# EAGLE design bldc (EAGLE 6.4)
Assembly variants: IRLR8726PBF
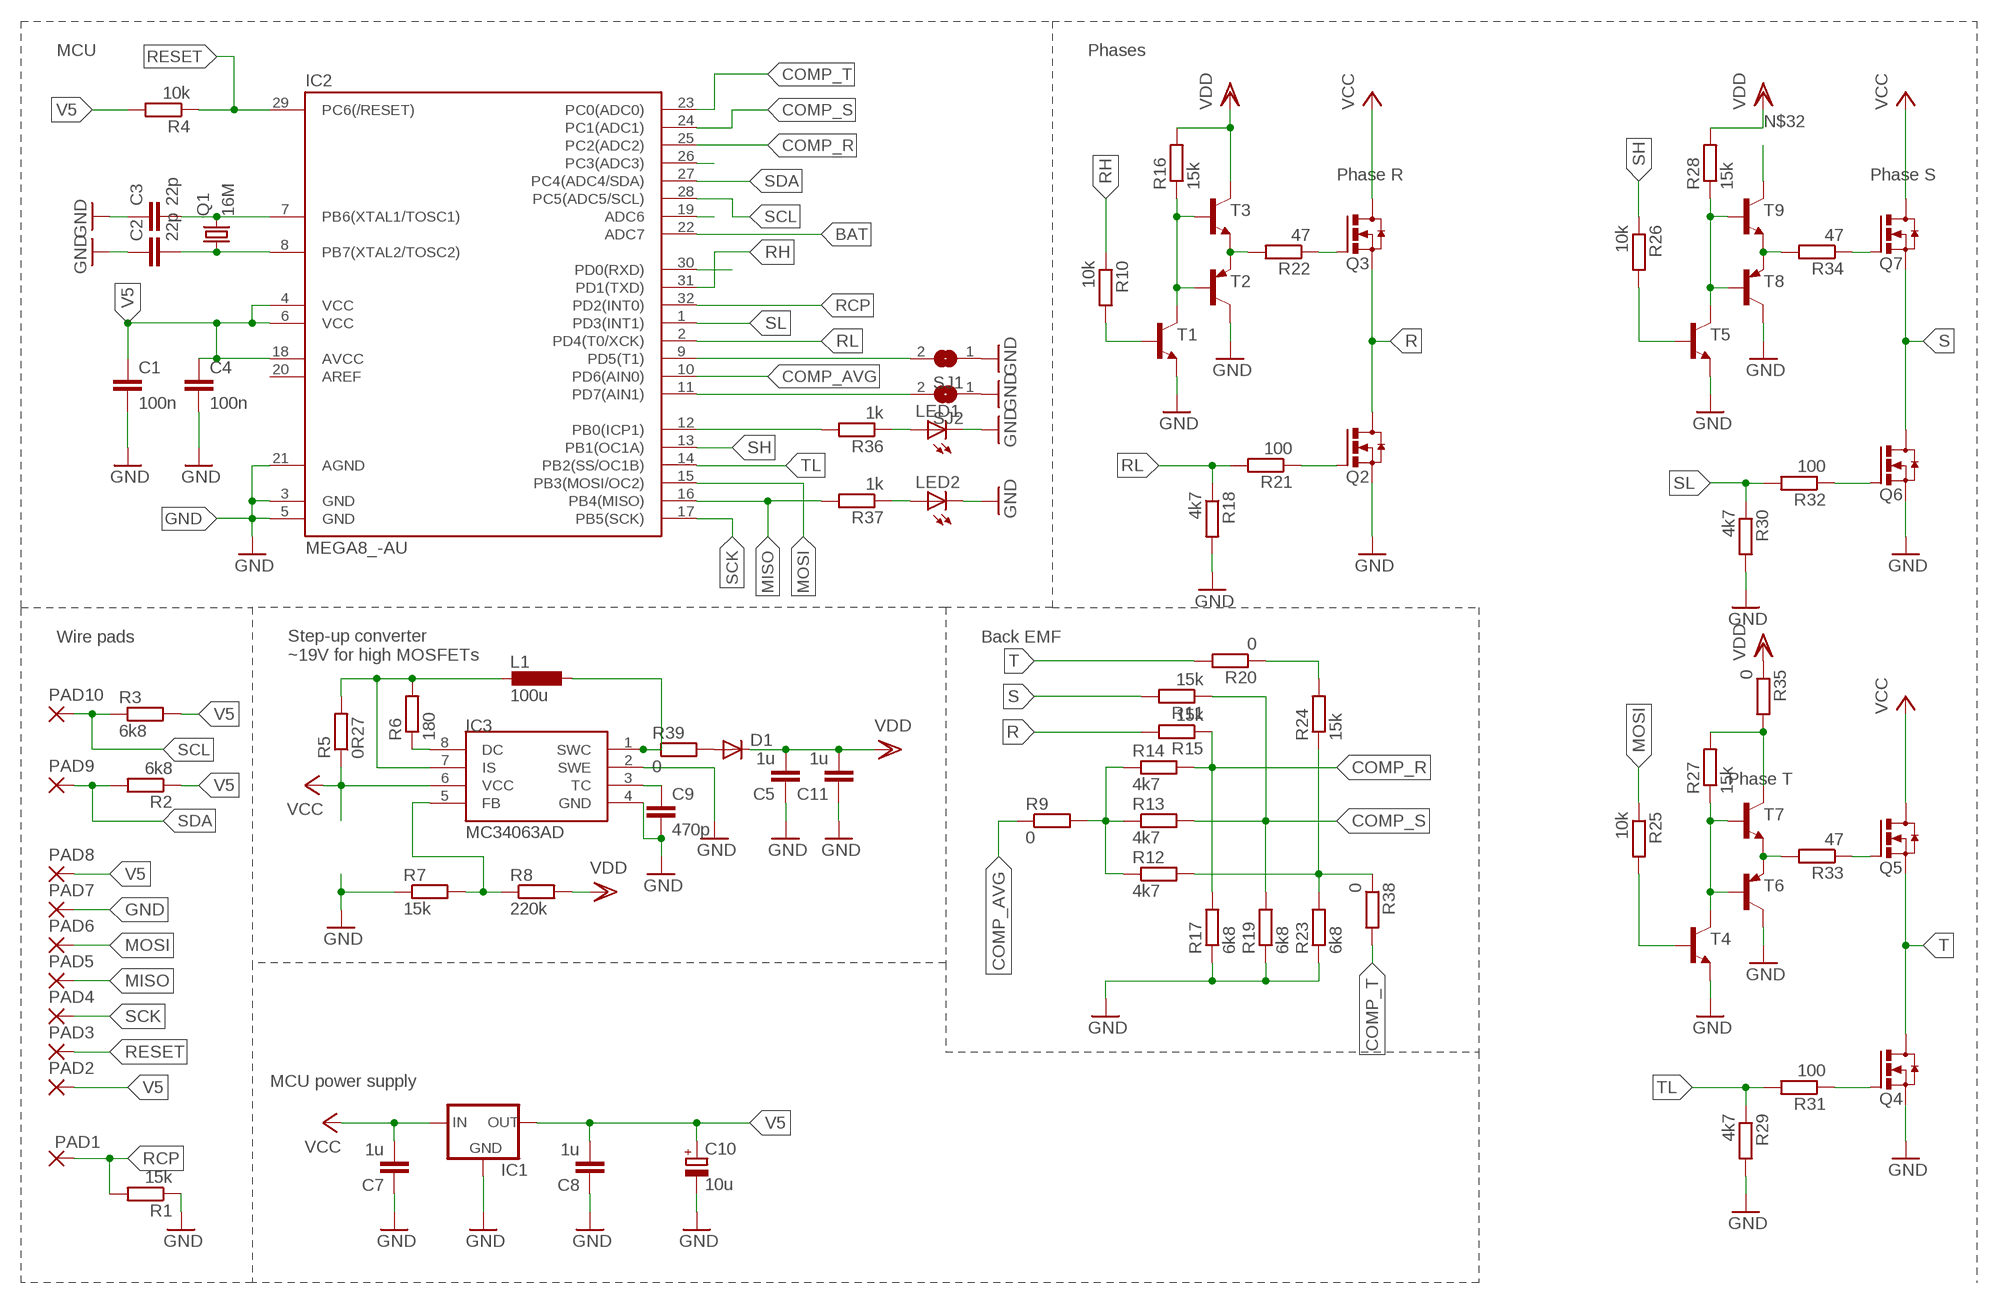
[diagram p0: schematic, sheet 1]

## Parts
C1  100n  C-EUC0805K  [C0805K]
C2  22p  C-EUC0805K  [C0805K]
C3  22p  C-EUC0805K  [C0805K]
C4  100n  C-EUC0805K  [C0805K]
C5  1u  C-EUC0805K  [C0805K]
C7  1u  C-EUC0805K  [C0805K]
C8  1u  C-EUC0805K  [C0805K]
C9  470p  C-EUC0805K  [C0805K]
C10  10u  CPOL-EUE2.5-4V  [E2,5RE]
C11  1u  C-EUC0805K  [C0805K]
D1  DIODE-SOD80C  [SOD80C]
IC1  LM1117TO252  [TO252]
IC2  MEGA8_-AU  [TQFP32-08]
IC3  MC34063AD  [SOIC8]
L1  100u  L-EU0204/7  [0204/7]
LED1  LEDCHIPLED_0805  [CHIPLED_0805]
LED2  LEDCHIPLED_0805  [CHIPLED_0805]
PAD1  WIREPADSMD1,27-254  [SMD1,27-2,54]
PAD2  WIREPADSMD1,27-254  [SMD1,27-2,54]
PAD3  WIREPADSMD1,27-254  [SMD1,27-2,54]
PAD4  WIREPADSMD1,27-254  [SMD1,27-2,54]
PAD5  WIREPADSMD1,27-254  [SMD1,27-2,54]
PAD6  WIREPADSMD1,27-254  [SMD1,27-2,54]
PAD7  WIREPADSMD1,27-254  [SMD1,27-2,54]
PAD8  WIREPADSMD1,27-254  [SMD1,27-2,54]
PAD9  WIREPADSMD1,27-254  [SMD1,27-2,54]
PAD10  WIREPADSMD1,27-254  [SMD1,27-2,54]
Q1  16M  CRYSTALSM49  [SM49]
Q2  IRFR1205  [D-PAK_TO252AA]
Q3  IRFR1205  [D-PAK_TO252AA]
Q4  IRFR1205  [D-PAK_TO252AA]
Q5  IRFR1205  [D-PAK_TO252AA]
Q6  IRFR1205  [D-PAK_TO252AA]
Q7  IRFR1205  [D-PAK_TO252AA]
R1  15k  R-EU_R0805  [R0805]
R2  6k8  R-EU_R0805  [R0805]
R3  6k8  R-EU_R0805  [R0805]
R4  10k  R-EU_R0805  [R0805]
R5  0R27  R-EU_R0805  [R0805]
R6  180  R-EU_R0805  [R0805]
R7  15k  R-EU_R0805  [R0805]
R8  220k  R-EU_R0805  [R0805]
R9  0  R-EU_R0805  [R0805]
R10  10k  R-EU_R0805  [R0805]
R11  15k  R-EU_R0805  [R0805]
R12  4k7  R-EU_R0805  [R0805]
R13  4k7  R-EU_R0805  [R0805]
R14  4k7  R-EU_R0805  [R0805]
R15  15k  R-EU_R0805  [R0805]
R16  15k  R-EU_R0805  [R0805]
R17  6k8  R-EU_R0805  [R0805]
R18  4k7  R-EU_R0805  [R0805]
R19  6k8  R-EU_R0805  [R0805]
R20  0  R-EU_WIDE1206  [R1206]
R21  100  R-EU_R0805  [R0805]
R22  47  R-EU_R0805  [R0805]
R23  6k8  R-EU_R0805  [R0805]
R24  15k  R-EU_R0805  [R0805]
R25  10k  R-EU_R0805  [R0805]
R26  10k  R-EU_R0805  [R0805]
R27  15k  R-EU_R0805  [R0805]
R28  15k  R-EU_R0805  [R0805]
R29  4k7  R-EU_R0805  [R0805]
R30  4k7  R-EU_R0805  [R0805]
R31  100  R-EU_R0805  [R0805]
R32  100  R-EU_R0805  [R0805]
R33  47  R-EU_R0805  [R0805]
R34  47  R-EU_R0805  [R0805]
R35  0  R-EU_WIDE1206  [R1206]
R36  1k  R-EU_R0805  [R0805]
R37  1k  R-EU_R0805  [R0805]
R38  0  R-EU_R0805  [R0805]
R39  0  R-EU_R0805  [R0805]
SJ1  SJ  [SJ]
SJ2  SJ  [SJ]
T1  BC847  [SOT23]
T2  BC807-16-PNP-SOT23-BEC  [SOT23-BEC]
T3  BC847  [SOT23]
T4  BC847  [SOT23]
T5  BC847  [SOT23]
T6  BC807-16-PNP-SOT23-BEC  [SOT23-BEC]
T7  BC847  [SOT23]
T8  BC807-16-PNP-SOT23-BEC  [SOT23-BEC]
T9  BC847  [SOT23]

## Nets
BAT: IC2.22(ADC7)
COMP_AVG: IC2.10(PD6(AIN0)) R9.1
COMP_R: IC2.25(PC2(ADC2)) R14.2 R15.1 R17.2
COMP_S: IC2.24(PC1(ADC1)) R11.1 R13.2 R19.2
COMP_T: IC2.23(PC0(ADC0)) R38.2
GND: C1.2 C2.1 C3.1 C4.2 C5.1 C7.1 C8.1 C9.2 C10.- C11.1 IC1.1(GND) IC2.3(GND) IC2.5(GND) IC2.21(AGND) IC3.2(SWE) IC3.4(GND) LED1.C LED2.C PAD7.1(P) Q2.3(S) Q4.3(S) Q6.3(S) R1.1 R7.1 R17.1 R18.2 R19.1 R23.1 R29.2 R30.2 SJ1.1 SJ2.1 T1.2(E) T2.C T4.2(E) T5.2(E) T6.C T8.C
MISO: IC2.16(PB4(MISO)) PAD5.1(P) R37.2
MOSI: IC2.15(PB3(MOSI/OC2)) PAD6.1(P) R25.1
N$1: R10.2 T1.1(B)
N$3: R9.2 R12.1 R13.1 R14.1
N$4: R16.1 T1.3(C) T2.B T3.1(B)
N$5: Q3.1(G) R22.1
N$6: R22.2 T2.E T3.2(E)
N$9: Q4.1(G) R31.1
N$10: Q2.1(G) R21.1
N$11: Q6.1(G) R32.1
N$13: IC3.5(FB) R7.2 R8.1
N$14: IC3.8(DC) R6.1
N$15: IC3.1(SWC) L1.1 R39.1
N$16: IC3.7(IS) L1.2 R5.2 R6.2
N$17: R28.1 T5.3(C) T8.B T9.1(B)
N$18: C2.2 IC2.8(PB7(XTAL2/TOSC2)) Q1.1
N$19: C3.2 IC2.7(PB6(XTAL1/TOSC1)) Q1.2
N$22: Q7.1(G) R34.1
N$23: R34.2 T8.E T9.2(E)
N$24: R26.2 T5.1(B)
N$26: Q5.1(G) R33.1
N$28: R20.1 R24.2
N$30: R27.1 T4.3(C) T6.B T7.1(B)
N$31: R33.2 T6.E T7.2(E)
N$32: R27.2 R35.2 T7.3(C) T9.3(C)
N$33: IC2.12(PB0(ICP1)) R36.2
N$35: IC2.11(PD7(AIN1)) SJ2.2
N$36: R25.2 T4.1(B)
N$37: IC2.9(PD5(T1)) SJ1.2
N$40: IC2.30(PD0(RXD))
N$41: IC2.19(ADC6)
N$43: IC2.26(PC3(ADC3))
N$46: LED2.A R37.1
N$47: LED1.A R36.1
N$48: R12.2 R23.2 R24.1 R38.1
N$50: C9.1 IC3.3(TC)
N$55: D1.A R39.2
R: Q2.4(D) Q3.3(S) R15.2
RCP: IC2.32(PD2(INT0)) PAD1.1(P) R1.2
RESET: IC2.29(PC6(/RESET)) PAD3.1(P) R4.1
RH: IC2.31(PD1(TXD)) R10.1
RL: IC2.2(PD4(T0/XCK)) R18.1 R21.2
S: Q6.4(D) Q7.3(S) R11.2
SCK: IC2.17(PB5(SCK)) PAD4.1(P)
SCL: IC2.28(PC5(ADC5/SCL)) PAD10.1(P) R3.1
SDA: IC2.27(PC4(ADC4/SDA)) PAD9.1(P) R2.2
SH: IC2.13(PB1(OC1A)) R26.1
SL: IC2.1(PD3(INT1)) R30.1 R32.2
T: Q4.4(D) Q5.3(S) R20.2
TL: IC2.14(PB2(SS/OC1B)) R29.1 R31.2
V5: C1.1 C4.1 C8.2 C10.+ IC1.3(OUT) IC2.4(VCC) IC2.6(VCC) IC2.18(AVCC) PAD2.1(P) PAD8.1(P) R2.1 R3.2 R4.2
VCC: C7.2 IC1.2(IN) IC3.6(VCC) Q3.4(D) Q5.4(D) Q7.4(D) R5.1
VDD: C5.2 C11.2 D1.C R8.2 R16.2 R28.2 R35.1 T3.3(C)
Unconnected: IC2.20(AREF)

## Notes on the sheet
- MCU | Phases
- Phase R | Phase S
- Wire pads | Back EMF
- Step-up converter
  ~19V for high MOSFETs
- Phase T
- MCU power supply

## Library data of the parts
C1-C5 C7 C8 C11 = rcl2:C-EU: CAPACITOR, European symbol
C9 = rcl:C-EU: CAPACITOR, European symbol
C10 = rcl:CPOL-EU: POLARIZED CAPACITOR, European symbol
D1 = diode:DIODE-: DIODE
IC1 = v-reg-2:LM1117
IC2 = avr-4:MEGA8_
IC3 = mc34063:MC34063
L1 = rcl:L-EU: INDUCTOR, European symbol
LED1 LED2 = led:LED: LED OSRAM: - CHIPLED LG R971, LG N971, LY N971, LG Q971, LY Q971, LO R971, LY R971 LH N974, LH R974 LS Q976, LO Q976, LY Q976 LO Q996 - Hyper CHIPLED LW Q18S LB Q993, LB Q99A, LB R99A - SideLED LS A670, LO A670, LY A670, LG A670, LP A670 LB A673, LV A673, LT A673, LW A673 LH A674 LY A675 LS A676, LA A676, LO A676, LY A676, LW A676 LS A679, LY A679, LG A679 - Hyper Micro SIDELED® LS Y876, LA Y876, LO Y876, LY Y876 LT Y87S - SmartLED LW L88C, LW L88S LB L89C, LB L89S, LG L890 LS L89K, LO L89K, LY L89K LS L896, LA L896, LO L896, LY L896 - TOPLED LS T670, LO T670, LY T670, LG T670, LP T670 LSG T670, LSP T670, LSY T670, LOP T670, LYG T670 LG T671, LOG T671, LSG T671 LB T673, LV T673, LT T673, LW T673 LH T674 LS T676, LA T676, LO T676, LY T676, LB T676, LH T676, LSB T676, LW T676 LB T67C, LV T67C, LT T67C, LS T67K, LO T67K, LY T67K, LW E67C LS E67B, LA E67B, LO E67B, LY E67B, LB E67C, LV E67C, LT E67C LW T67C LS T679, LY T679, LG T679 LS T770, LO T770, LY T770, LG T770, LP T770 LB T773, LV T773, LT T773, LW T773 LH T774 LS E675, LA E675, LY E675, LS T675 LS T776, LA T776, LO T776, LY T776, LB T776 LHGB T686 LT T68C, LB T68C - Hyper Mini TOPLED® LB M676 - Mini TOPLED Santana® LG M470 LS M47K, LO M47K, LY M47K Source: http://www.osram.convergy.de LUXEON: - LUMILED® LXK2-PW12-R00, LXK2-PW12-S00, LXK2-PW14-U00, LXK2-PW14-V00 LXK2-PM12-R00, LXK2-PM12-S00, LXK2-PM14-U00 LXK2-PE12-Q00, LXK2-PE12-R00, LXK2-PE12-S00, LXK2-PE14-T00, LXK2-PE14-U00 LXK2-PB12-K00, LXK2-PB12-L00, LXK2-PB12-M00, LXK2-PB14-N00, LXK2-PB14-P00, LXK2-PB14-Q00 LXK2-PR12-L00, LXK2-PR12-M00, LXK2-PR14-Q00, LXK2-PR14-R00 LXK2-PD12-Q00, LXK2-PD12-R00, LXK2-PD12-S00 LXK2-PH12-R00, LXK2-PH12-S00 LXK2-PL12-P00, LXK2-PL12-Q00, LXK2-PL12-R00 Source: www.luxeon.com KINGBRIGHT: KA-3528ASYC Source: www.kingbright.com
PAD1-PAD10 = wirepad:WIREPAD: Wire PAD connect wire on PCB
Q1 = crystal:CRYSTAL: CRYSTAL; OC_FARNELL: unknown; OC_NEWARK: unknown
Q2-Q7 = transistor-power:IRFR1205
R1-R19 R21-R34 R36-R39 = rcl2:R-EU_: RESISTOR, European symbol
R20 R35 = rclwide:R-EU_: RESISTOR, European symbol
SJ1 SJ2 = jumper:SJ: SMD solder JUMPER
T1 T3-T5 T7 T9 = transistor2:BC847: NPN TRANSISTOR
T2 T6 T8 = transistor2:*-PNP-: PNP Transistror

## Board
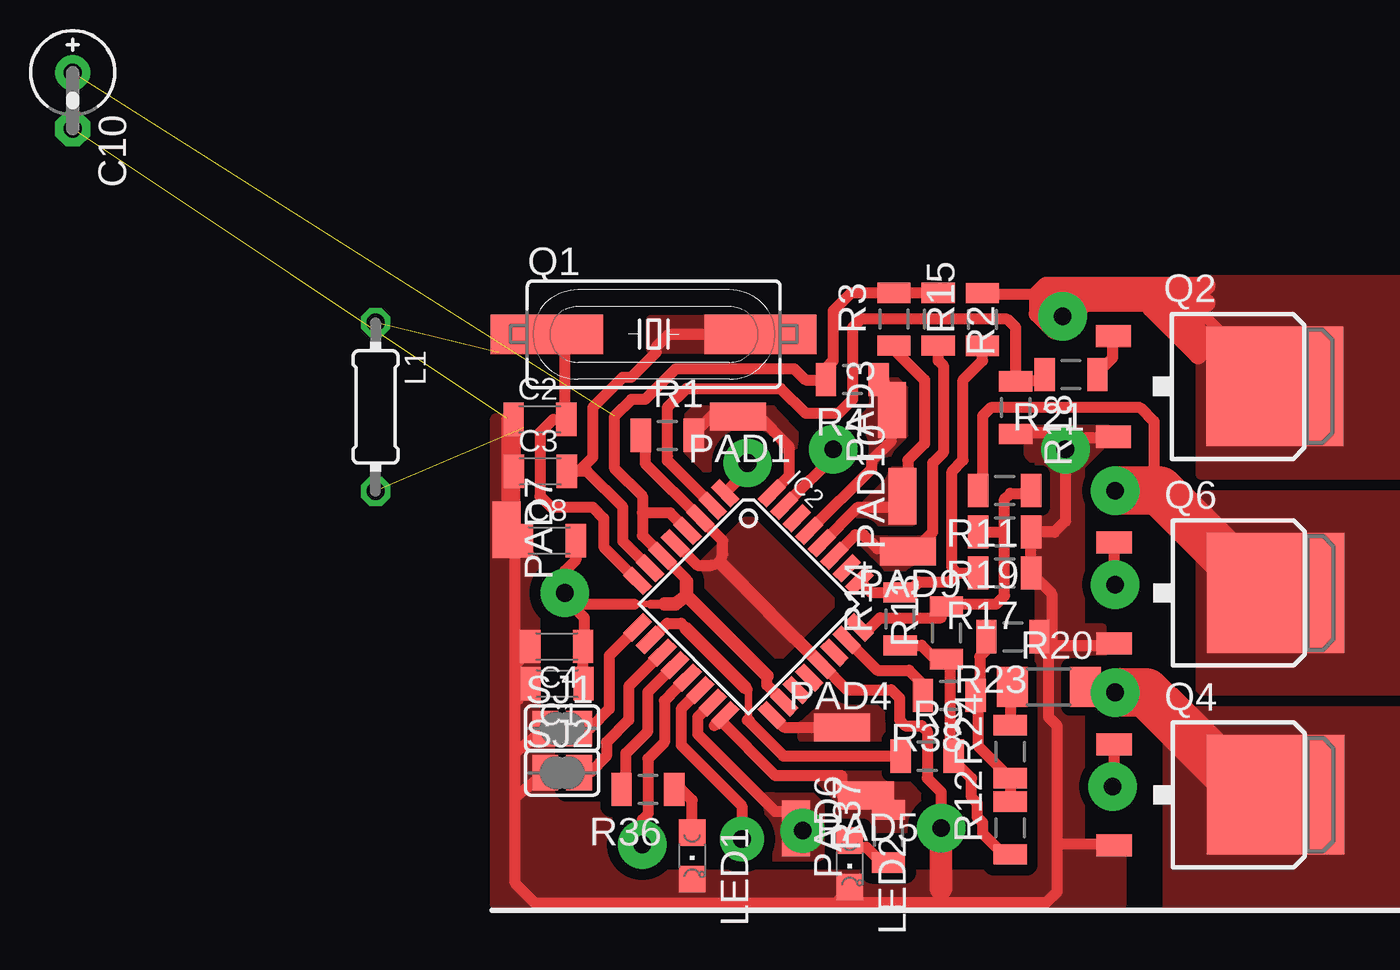
[diagram p1: board, top side]
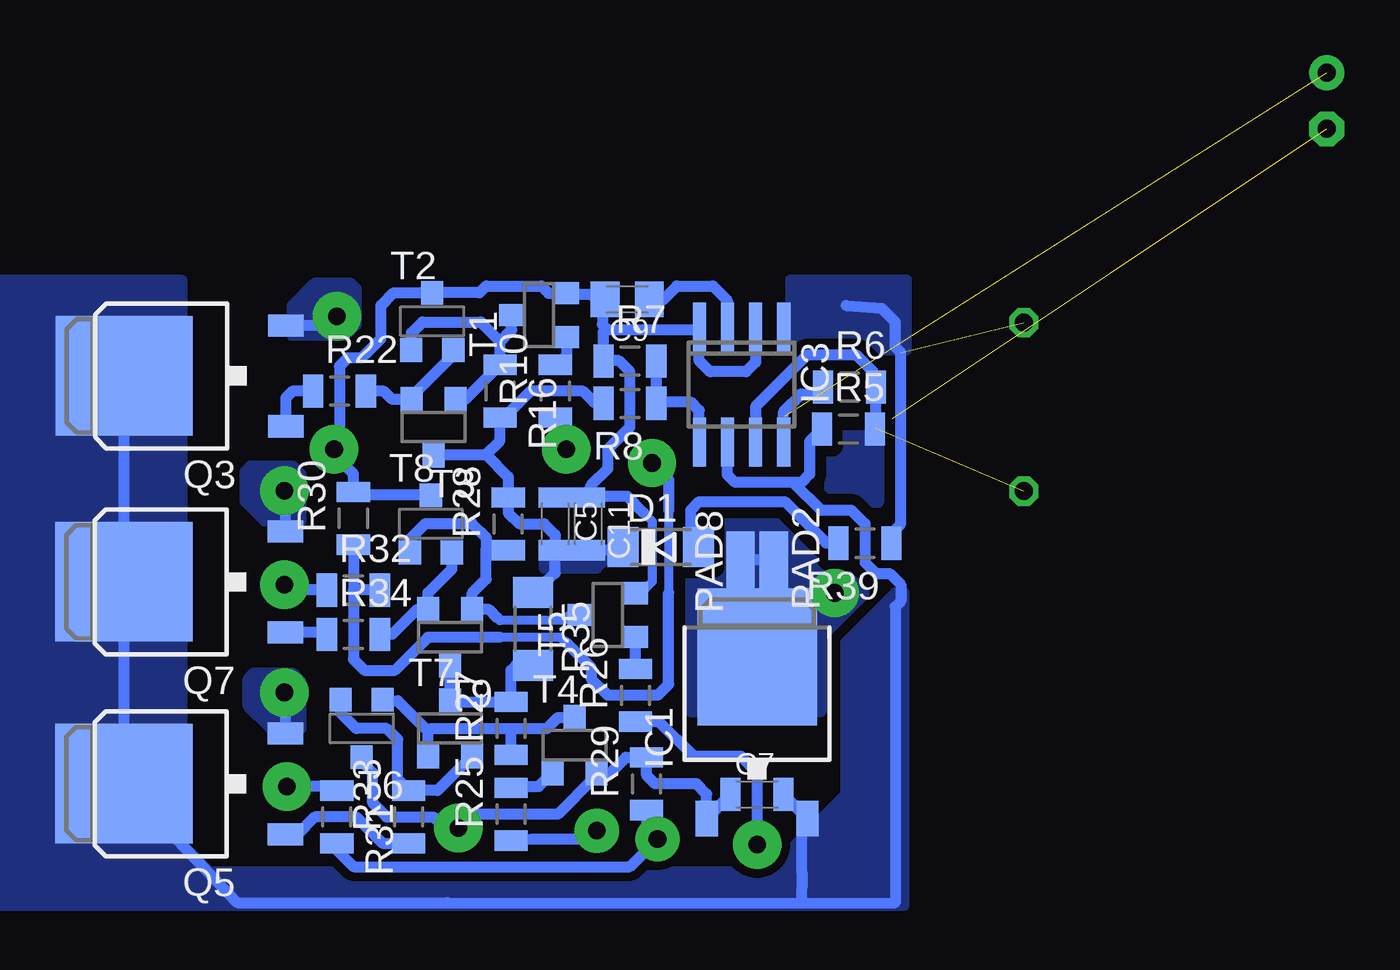
[diagram p2: board, bottom side, seen from below]

No outline drawn. Coordinates in mm, seen from the top.
Copper layers (1*2*16): Top 0.035mm / dielectric 1.5mm / Route2 0.035mm / dielectric 0.15mm / Bottom 0.035mm
Design rules "default *": minimum track width 10mil, minimum drill 24mil, track to track 8mil, track to pad 8mil, pad to pad 8mil, via to via 8mil, smd to smd 8mil, copper to edge 40mil, drill to drill 8mil, minimum pad ring 10mil, minimum via ring 8mil, stop-mask expansion 4mil, vias tented up to drill 0mil, thermal gap 10mil

### Footprints (pad centres in the part's own frame; a part is rotated, then mirrored left to right if it is on the bottom)
C0805K = smd 0.914 x 1.5: 1 -1.194,0; 2 1.194,0
C0805K' = smd 1.3 x 1.6: 1 -1,0; 2 1,0
E2,5RE = drill 0.813 pad 1.575: + -1.27,0 | drill 0.813 pad 1.575 octagon: - 1.27,0
SOD80C = smd 1.4 x 1.8: A 1.7,0; C -1.7,0
TO252 = smd 1 x 1.6: 1 -2.28,-6.07; 2 2.28,-6.07 | smd 5.4 x 6.2: 3 0,1.23
TQFP32-08 = smd 1.27 x 0.559: 1 -4.293,2.8; 2 -4.293,2; 3 -4.293,1.2; 4 -4.293,0.4; 5 -4.293,-0.4; 6 -4.293,-1.2; 7 -4.293,-2; 8 -4.293,-2.8; 17 4.293,-2.8; 18 4.293,-2; 19 4.293,-1.2; 20 4.293,-0.4; 21 4.293,0.4; 22 4.293,1.2; 23 4.293,2; 24 4.293,2.8 | smd 0.559 x 1.27: 9 -2.8,-4.293; 10 -2,-4.293; 11 -1.2,-4.293; 12 -0.4,-4.293; 13 0.4,-4.293; 14 1.2,-4.293; 15 2,-4.293; 16 2.8,-4.293; 25 2.8,4.293; 26 2,4.293; 27 1.2,4.293; 28 0.4,4.293; 29 -0.4,4.293; 30 -1.2,4.293; 31 -2,4.293; 32 -2.8,4.293
SOIC8 = smd 0.6 x 2.2: 1 -1.905,-2.6; 2 -0.635,-2.6; 3 0.635,-2.6; 4 1.905,-2.6; 5 1.905,2.6; 6 0.635,2.6; 7 -0.635,2.6; 8 -1.905,2.6
0204/7 = drill 0.813 octagon: 1 -3.81,0; 2 3.81,0
CHIPLED_0805 = smd 1.2 x 1.2: A 0,-1.05; C 0,1.05
SMD1,27-2,54 = smd 1.27 x 2.54: 1 0,0
SM49 = smd 5.08 x 1.778: 1 -4.826,0; 2 4.826,0
D-PAK_TO252AA = smd 1 x 1.6: 1 -2.28,-4.8; 3 2.28,-4.8 | smd 5.4 x 6.2: 4 0,2.5
R0805 = smd 0.914 x 1.5: 1 -1.194,0; 2 1.194,0
R1206 = smd 1.397 x 1.803: 1 -1.651,0; 2 1.651,0
SJ = smd 1.168 x 1.6: 1 -0.762,0; 2 0.762,0
SOT23 = smd 1 x 1.143: 1 -0.991,-1.245; 2 0.991,-1.245; 3 0,1.245
SOT23-BEC = smd 1 x 1.067: B -0.95,-1.295; C 0,1.295; E 0.95,-1.295

### Placement (x,y rotation side)
C1  -14.98,-274.85 180 top
C2  -15.76,-262.9 0 top
C3  -15.73,-265.25 0 top
C4  -15,-273.17 180 top
C5  -2,-267.62 270 bottom
C7  -11.12,-279.86 0 bottom
C8  -15.33,-268.39 0 top
C9  470p  [C0805K']  -5.25,-257.49 180 bottom
C10  -36.88,-248.5 270 top
C11  -3.5,-267.62 270 bottom
D1  -6.76,-268.68 0 bottom
IC1  -11.12,-274.88 0 bottom
IC2  -6.33,-271.25 315 top
IC3  -10.42,-261.32 180 bottom
L1  -23.18,-262.34 270 top
LED1  -8.88,-282.62 180 top
LED2  -1.75,-283 180 top
PAD1  -6.8,-262.77 90 top
PAD2  -11.88,-269.25 180 bottom
PAD3  0.15,-262.48 0 top
PAD4  -2.1,-276.82 270 top
PAD5  -1.02,-279.89 90 top
PAD6  -4.18,-281.39 180 top
PAD7  -17.27,-267.89 180 top
PAD8  -10.38,-269.25 0 bottom
PAD9  0.88,-268.88 90 top
PAD10  0.62,-266.38 0 top
Q1  -10.61,-259.05 0 top
Q2  14.96,-261.41 270 top
Q3  14.98,-260.94 90 bottom
Q4  15,-279.88 270 top
Q5  15,-279.38 90 bottom
Q6  15,-270.75 270 top
Q7  15,-270.25 90 bottom
R1  -10,-263.62 0 top
R2  2.25,-258.38 270 top
R3  0.25,-258.38 90 top
R4  -1.64,-261.11 180 top
R5  -15.25,-263.33 0 bottom
R6  -15.3,-261.44 0 bottom
R7  -5.38,-260.27 0 bottom
R8  -5.38,-262.18 180 bottom
R9  1.75,-278.12 0 top
R10  -2,-261.62 90 bottom
R11  5.25,-266.12 180 top
R12  5.5,-281.38 90 top
R13  2.62,-272.55 90 top
R14  0.53,-271.93 90 top
R15  4.25,-258.38 90 top
R16  0.5,-261.62 270 bottom
R17  5.25,-269.85 180 top
R18  5.75,-262.38 270 top
R19  5.25,-268 180 top
R20  7.25,-275 0 top
R21  8.25,-260.88 180 top
R22  7.75,-261.62 0 bottom
R23  5.62,-272.73 180 top
R24  5.5,-277.93 90 top
R25  0,-280.75 90 bottom
R26  -5.62,-275.38 90 bottom
R27  0,-276.88 90 bottom
R28  0.12,-267.62 90 bottom
R29  -6.12,-279.38 90 bottom
R30  7.12,-267.38 90 bottom
R31  7.88,-280.88 270 bottom
R32  7.12,-270.62 0 bottom
R33  4.62,-280.88 90 bottom
R34  7.12,-272.62 0 bottom
R35  -1,-272.38 270 bottom
R36  -10.88,-279.62 180 top
R37  0,-281.75 90 top
R38  2.75,-275.38 180 top
R39  -16,-268.5 180 bottom
SJ1  -14.75,-276.88 0 top
SJ2  -14.75,-278.88 0 top
T1  -1.27,-258.19 90 bottom
T2  3.56,-258.48 0 bottom
T3  3.5,-263.25 180 bottom
T4  -2.88,-277.62 0 bottom
T5  -4.38,-271.75 90 bottom
T6  6.75,-276.88 180 bottom
T7  2.75,-276.88 0 bottom
T8  3.62,-267.62 0 bottom
T9  2.75,-272.75 180 bottom

### Tracks (layer width: path | path; a pad name or v marks a point on that pad's centre or on a via)
COMP_AVG
  Top 0.2: -6.25,-275.25 -6.25,-276.5
  Top 0.254: -6.38,-275.12 -6.38,-276.5
  Top 0.406: -6.25,-276.5 -6.38,-276.5
  Top 0.5: IC2.10 -10.75,-272.88 -10,-272.12 -9.38,-272.12 -9.12,-272.38 | -6.38,-276.5 -4.75,-278.12 R9.1 | -6.38,-275.12 -6.5,-275
  Top 0.61: -6.5,-275 -9.12,-272.38
COMP_R
  Top 0.5: 0.22,-270.86 R14.2 | IC2.25 -0.78,-270.73 R14.2 | R14.2 0.51,-270.62 1,-270.62 1.38,-270.25 2.75,-270.25 3.12,-269.88 | R15.1 4.25,-260.25 3.38,-261.12 3.38,-264.75 2.88,-265.25 2.88,-269.62 3.12,-269.88 | R17.2 3.91,-269.88 3.12,-269.88
COMP_S
  Top 0.5: IC2.24 -1.06,-272.56 -0.38,-271.88 2.38,-271.88 2.38,-271.48 R13.2 2.89,-271.36 3,-271.25 4.88,-271.25 5.25,-270.88 5.25,-268 | 5.25,-268 5.25,-266.5 5.5,-266.25 6.32,-266.25 R11.1 | R19.2 5.25,-268
COMP_T
  Top 0.5: IC2.23 -0.5,-274.25 0.93,-274.25 1.56,-274.88 R38.2
GND  (via drill 0.8 pad 2.18)  (1 unrouted)
  Top 0.5: 10.2,-273 Q6.3 10.11,-273.12 9.88,-273.12 | IC2.5 -9.65,-268.48 -8.62,-269.5 -8,-269.5 -7.62,-269.38 -7.5,-269 -7.5,-268.39 IC2.3 -11,-264.89 -11,-264.16 -11.19,-263.97 R1.1 | -16.88,-280 -16.88,-283.88 -16,-284.75 -2.38,-284.75 | -16.88,-280 -16.88,-278 | -16.88,-278 -16.88,-275.5 | -16.88,-275.5 -16.88,-274 | -16.88,-274 -16.88,-265.95 C3.1 | Q4.3 10.11,-282.25 9.98,-282.12 7.62,-282.12 | C4.2 -16.67,-273.8 -16.88,-274 | C1.2 -16.77,-275.6 -16.88,-275.5 | SJ2.1 -16.88,-280 | SJ1.1 -16.75,-277.88 -16.88,-278 | LED1.C -8.93,-283.68 -9,-283.75 | Q2.3 10.11,-263.75 8.88,-263.75 8.38,-264.25 v8,-264.25 | R18.2 5.81,-263.5 7.38,-263.5 8,-264.12 v8,-264.25 | IC2.21 -2.99,-274.01 -1.88,-275.12 0.12,-275.12 0.5,-275.5 0.5,-276.5 0.75,-276.75 1.5,-276.75 1.75,-277 1.75,-279.12 2.38,-279.75 2.38,-281.25 v2.38,-281.38 2.38,-284.12 2.25,-284.25 2.25,-284.75 | 7.62,-282.12 7.62,-284.25 7.12,-284.75 2.25,-284.75 | 7.62,-282.12 7.62,-276.75 7.25,-276.38 7.25,-273.25 | 7.25,-273.25 7.38,-273.12 | 7.38,-273.12 9.88,-273.12 | LED2.C -2.38,-284.75 | v8,-264.25 8,-267.5 7.5,-268 R19.1 R17.1 7.38,-270.78 7.38,-273.12 | 6.69,-272.61 R23.1 6.82,-273.07 7.25,-273.25 | 2.25,-284.75 -2.38,-284.75 | 9.88,-273.12 9.62,-272.88 | PAD7.1 -17.25,-267.88 -17.25,-262.88 -17,-262.88
  Top 0.61: IC2.21 -5.38,-271.64 -5.38,-271.62 -7.62,-269.38 | C3.1 -16.92,-263.43 C2.1
  Top 1.016: 2.38,-284.12 2.38,-281.25
  Bottom 0.406: -5.87,-270.76 -6.38,-270.25 -6.38,-267.5 -6,-267.12 | C11.1 -3.68,-266.38
  Bottom 0.5: C7.1 -8.72,-281.07 IC1.1 -8.85,-279.85 -8.38,-279.38 -6.5,-279.38 -6.12,-279 R29.2 -5.19,-278.18 -4.5,-278.88 T4.2 -3.87,-279.13 -3.74,-279.13 -2.12,-280.75 1.5,-280.75 2.12,-281.38 v2.38,-281.38 3,-281.38 3.5,-280.88 5.62,-280.88 6.25,-280.25 6.25,-278.88 6.62,-278.5 T6.C 6.75,-278.3 | IC3.2 -11.05,-260.32 -10.62,-260.75 -9,-260.75 -8.5,-260.25 -8.5,-258.74 IC3.4 -8.39,-258.85 -4.38,-258.85 | -4.38,-258.85 -4.28,-258.85 -4.18,-258.95 R7.1 -4.15,-260.25 -4.88,-260.25 -5.38,-260.75 -5.38,-263.25 -4.38,-264.25 -4.38,-265.12 -3.62,-265.88 C11.1 C5.1 | T5.2 -5.87,-270.76 | -3.68,-266.38 -5.25,-266.38 -6,-267.12 | T8.C 7.1,-266.33 R30.2 7.12,-265.38 8,-264.5 v8,-264.25 8,-263.5 7.75,-263.25 7.75,-260.5 7.38,-260.12 6.75,-260.12 5.88,-259.25 5.88,-257.75 5.3,-257.18 T2.C 1.43,-257.18 1.12,-256.88 -1.38,-256.88 -1.69,-257.19 T1.2 -2.57,-257.25 -3.62,-257.25 -3.86,-257.49 C9.2 -4.13,-257.6 -4.13,-258.61 -4.38,-258.85
  pour Top (isolate 0.4, no thermals): 6.88,-264.25 8.62,-264.25 8.62,-284.75 7,-284.75 7,-275.62 6.88,-275.62
  pour Top (isolate 0.5, no thermals): -17.75,-262.88 -17,-262.88 -17,-268.25 -16,-269.25 -16,-276.5 -15.25,-277.25 -15.25,-279.25 -12.12,-279.25 -12.12,-283.5 6.38,-283.5 7.62,-282.25 10.5,-282.25 10.5,-284.88 -17.75,-284.88
  pour Top (isolate 0.5, no thermals): 6.38,-264.38 6.38,-263.75 6.75,-263.38 9.88,-263.38 10,-263.5 10,-263.62 8.62,-265 6.88,-265 6.38,-264.5
  pour Top (isolate 0.5, no thermals): 8.62,-273.5 9.62,-273.5 9.62,-272.38 8.62,-272.38
  pour Top (isolate 0.5): -8.88,-270 -6.38,-267.5 -6.25,-267.5 -2.62,-271.12 -2.62,-271.25 -5.38,-274 -5.62,-274 -8.88,-270.75
MISO
  Top 0.5: IC2.16 -7.62,-276.5 -7.88,-276.75 -7.62,-276.5 -5.12,-279 -2.12,-279 -2.1,-279.89 PAD5.1 -1.65,-279.86 -1.19,-280.06 R37.2
  pour Top (isolate 0.4, no thermals): -3.38,-278.88 0.25,-278.88 2,-280.62 2,-281.38 -2.12,-281.38 -2.12,-280.12
MOSI  (via drill 0.8 pad 2)
  Top 0.5: IC2.15 -8.62,-276.38 -8.62,-277.12 -5.12,-280.62 -4.5,-280.62 v-3.88,-281.5 -4.12,-281.67 PAD6.1
  Bottom 0.5: R25.1 -0.94,-281.88 -3.75,-281.88 -3.88,-281.75 v-3.88,-281.5
  pour Top (isolate 0.5, no thermals): -5.38,-280.62 -5.38,-281.25 -6.12,-282.25 -6.5,-282.25 -6.62,-282.38 -6.62,-282.62 -3.12,-282.62 -3.12,-280.38 -3.5,-280 -5.5,-280
N$1
  Bottom 0.5: T1.1 -2.52,-260.04 R10.2
N$3
  Top 0.5: 5.43,-282.75 R12.1 | R14.1 1.5,-273.12 2.12,-273.74 R13.1 2.5,-273.75 2.78,-274.03 2.78,-277.83 R9.2 2.94,-278.32 3.75,-279.12 3.75,-280 4,-280.25 4,-280.88 4.25,-281.12 4.25,-281.62 5.32,-282.69 R12.1 | 5.38,-282.75 R12.1
N$4
  Bottom 0.5: T2.B 4.5,-259 4,-258.5 1.38,-258.5 0.5,-259.38 | 2.5,-262.25 T3.1 2.08,-262.01 R16.1 0.5,-259.38 | 0.5,-259.38 -0.03,-258.85 T1.3
N$5
  Bottom 0.5: 10.25,-263.14 Q3.1 10.18,-261.93 9.88,-261.62 R22.1
N$6
  Bottom 0.5: T2.E 2.48,-259.86 4.25,-261.62 4.25,-261.77 T3.2 4.5,-262 5.38,-262 5.75,-261.62 R22.2
N$9  (via drill 0.8 pad 2.18)
  Top 0.5: v10.12,-279.5 10.2,-279.43 Q4.1
  Bottom 0.5: 10,-279.5 v10.12,-279.5 8.18,-279.5 R31.1
N$10
  Top 0.5: Q2.1 10.16,-259.33 10.12,-259.38 10.12,-260.12 9.44,-260.81 R21.1
N$11  (via drill 0.8 pad 2.18)
  Top 0.5: v10.25,-270.38 10.2,-270.18 Q6.1
  Bottom 0.5: R32.1 10,-270.62 v10.25,-270.38
N$13
  Bottom 0.5: R8.1 R7.2 | -6.64,-262.06 R8.1 | IC3.5 -8.5,-263.91 -8.5,-262.5 -8.12,-262.12 -6.57,-262.12 R8.1
N$14
  Bottom 0.5: IC3.8 -12.32,-262.55 -13.12,-261.75 -13.67,-261.75 R6.1
N$15  (1 unrouted)
  Bottom 0.5: -15.16,-257.75 -16.75,-257.88 -17.38,-258.5 -17.38,-259.62 -17.62,-259.88 -17.62,-267.62 -17.12,-268.12 -17.12,-268.43 R39.1
  pour Bottom (isolate 0.5, no thermals): -17.88,-256.62 -12.62,-256.62 -12.62,-259.75 -17.88,-259.75
N$16  (1 unrouted)
  Bottom 0.5: R6.2 -16.45,-261.39 | -11,-263.87 IC3.7 -11.05,-262.32 -13.38,-260 -15.62,-260 -16.37,-260.74 R6.2 | R5.2 -16.49,-263.29 R6.2
  pour Bottom (isolate 0.5, no thermals): -16.62,-263.62 -16.62,-266.62 -16.38,-266.88 -13.88,-267 -13.62,-266.75 -13.62,-263.75 -13.75,-263.62
N$17
  Bottom 0.406: 0.62,-271.88 0.5,-272 -2.38,-272 -2.62,-271.75 T5.3
  Bottom 0.5: 1.75,-271.25 T9.1 | 1.12,-268.75 -0.06,-268.75 R28.1 | T9.1 1.76,-270.76 1.12,-270.12 1.12,-268.75 | 4.58,-268.82 T8.B 4.62,-268.87 4.62,-268.38 3.88,-267.62 1.75,-267.62 1.12,-268.25 1.12,-268.75 | T9.1 0.99,-271.5 0.62,-271.88
N$18
  Top 0.5: Q1.1 -14.82,-259.05 -14.62,-259.25 -14.62,-262.74 -14.46,-262.9 C2.2 -15.15,-262.9 -15.75,-263.5 -15.75,-266.38 -15.25,-266.88 -13.38,-266.88 -12.88,-267.38 -12.88,-268.67 IC2.8
N$19
  Top 0.5: -5.5,-259 -4.71,-258.88 Q1.2 -9.93,-259.05 -10.5,-259.62 -10.5,-259.88 -11.62,-261 -12,-261 -13.38,-262.38 -13.38,-264.62 -14,-265.25 | -14,-265.25 C3.2 | IC2.7 -12,-268.41 -12,-266.88 -13.62,-265.25 -14,-265.25
  pour Top (no thermals): -8.12,-259.75 -10.75,-259.75 -10.75,-258.38 -8.12,-258.38
N$22
  Bottom 0.5: Q7.1 8.6,-272.53 R34.1
N$23
  Bottom 0.5: 5.75,-272.88 R34.2 5.38,-272.62 4.25,-271.5 T9.2 3.75,-271.5 3.75,-270.75 2.67,-269.68 T8.E
N$24
  Bottom 0.5: R26.2 -5.56,-274.12 -5.62,-273.93 T5.1
N$26
  Bottom 0.5: 4.94,-282 R33.1 5.81,-282.07 7,-280.88 8.88,-280.88 9.65,-281.65 Q5.1
N$28
  Top 0.5: R20.1 5.5,-275.78 R24.2
N$30
  Bottom 0.5: T4.3 -2.12,-276.38 -1.62,-276.88 0,-276.88 | R27.1 0,-276.88 | T7.1 3.75,-277.88 3.75,-277 | 3.75,-277 3.62,-276.88 0,-276.88 | T6.B 5.63,-275.62 5.12,-275.62 3.75,-277
N$31
  Bottom 0.5: T7.2 3.32,-279.68 R33.2 5.12,-279.18 5.12,-277.38 5.62,-276.88 7,-276.88 7.7,-276.18 T6.E
N$32
  Bottom 0.5: T9.3 T7.3 2.57,-275.68 R27.2 0,-274.25 -0.22,-274.03 R35.2
N$33
  Top 0.5: IC2.12 -10.88,-275.23 -10.88,-277 -11.88,-278 -11.88,-279.43 R36.2
N$35
  Top 0.5: IC2.11 -11.75,-274.98 -11.75,-276.5 -12.75,-277.5 -12.75,-278.12 -13.5,-278.88 SJ2.2 -13.62,-279
N$36
  Bottom 0.5: R25.2 -0.06,-279.5 -1.25,-279.5 T4.1
N$37
  Top 0.5: IC2.9 -12.62,-273.59 -12.62,-276 -13.5,-276.88 SJ1.2
N$46
  Top 0.5: LED2.A -1.45,-282.25 -1,-282.25 -0.31,-282.94 R37.1
N$47
  Top 0.5: LED1.A -8.93,-281.51 -8.88,-281.44 -8.88,-280.12 -9.38,-279.62 R36.1
N$48
  Top 0.5: R23.2 4.43,-273.32 4.12,-273.62 4.12,-275.19 R38.1 4.07,-275.38 4.07,-277.69 5.37,-278.99 R24.1 R12.2
N$50
  Bottom 0.5: IC3.3 -9.79,-257.54 -9.12,-256.88 -7.5,-256.88 -6.88,-257.5 -6.26,-257.5 C9.1
N$55
  Bottom 0.5: D1.A -8.12,-268.33 -8.12,-267 -8.5,-266.62 -12.38,-266.62 -14.25,-268.5 R39.2
R  (via drill 0.8 pad 2.18)
  Top 0.5: Q2.4 13.05,-257 8.38,-257 7.88,-257.38 7.88,-257.88 | 7.88,-257.88 v7.88,-258.25 | R15.2 4.31,-257.25 6.62,-257.25 7.25,-257.88 7.88,-257.88
  Top 0.813: 14.38,-256.88 7.12,-256.88 6.75,-257.25 6.75,-258.12 7.5,-258.88 8.12,-258.88 8.5,-258.5 8.5,-258 8.88,-257.62 | 8.88,-257.62 11.88,-257.62 | 11.88,-257.62 14.38,-257.62 | 8.88,-257.62 7.5,-257.62 7.38,-257.5 7.38,-258 7.62,-258.25 | 11.88,-257.62 11.88,-257.88 14,-260 14,-258.88 12.88,-257.75
  Bottom 0.5: v7.88,-258.25 8.15,-258.65 Q3.3
  pour Top (isolate 0.5, no thermals): 14.12,-256.75 14.12,-265.38 28.5,-265.38 28.5,-256.62 14.25,-256.62
  pour Bottom (no thermals): 9.88,-259.12 9.88,-257.75 8.88,-256.75 7.25,-256.75 7,-257 7,-258.62 7.5,-259.12
RCP
  Top 0.406: PAD1.1 -7.62,-262.7 -7.62,-262.62
  Top 0.5: -8.88,-263.62 -8.81,-263.56 | -8.81,-263.56 -7.88,-262.62 -7.62,-262.62 -6,-262.62 -4.5,-264.12 -4.5,-265.46 IC2.32 | R1.2 -8.81,-263.56
  pour Top (isolate 0.5, no thermals): -9.12,-262.12 -9.12,-264.25 -8.25,-265.12 -6.12,-265.12 -4,-263.88 -5.62,-262.12
RESET
  Top 0.5: R4.1 -0.32,-260.82 PAD3.1 0.12,-262.5 0.12,-263.88 -0.75,-264.75 -0.75,-265.12 -3.56,-267.94 IC2.29
  pour Top (isolate 0.5, no thermals): -0.75,-260.88 -0.75,-262.12 -1.5,-263 -1.5,-264.38 -0.12,-265.62 1,-263.5 1,-261.38 0.88,-261.25 -0.38,-261.25
RH  (via drill 0.8 pad 2.18)
  Top 0.5: IC2.31 -2.25,-264.35 v-2.5,-264.25
  Bottom 0.5: v-2.5,-264.25 -2,-263.75 R10.1
RL
  Top 0.5: IC2.2 -9.99,-264.76 -9.99,-264.63 -10,-264.5 -10,-262.38 -9.12,-261.5 -4.88,-261.5 -3.75,-262.62 -2.25,-262.62 -1.62,-262 -1.62,-258.75 -1.25,-258.38 5.38,-258.38 5.75,-258.75 R18.1 7.11,-261.18 R21.2
S  (via drill 0.8 pad 2.18)
  Top 0.5: Q6.4 12.88,-266.12 12.25,-266.12 | R11.2 4.25,-265.93 4.25,-262.75 4.62,-262.38 11.38,-262.38 12,-263 12,-266.12
  Top 2.184: v10.25,-266.12 12,-266.12 12.25,-266.12 15.5,-269.38
  Bottom 0.5: v10.25,-266.12 10.2,-266.18 Q7.3
  pour Top (isolate 0.5, no thermals): 14.12,-266.38 14.12,-275.12 28.5,-275.12 28.5,-266.38
  pour Bottom (no thermals): 9.5,-265.38 9.5,-267.5 11.12,-267.5 12,-266.62 12,-265.25 11.75,-265 9.88,-265
SCK
  Top 0.5: IC2.17 -4.72,-276.82 PAD4.1
  pour Top (isolate 0.4, no thermals): -3.88,-277.25 -3.88,-276.75 -2.62,-275.62 -1,-275.62 0,-276.62 0,-277.38 -3.75,-277.38
SCL
  Top 0.5: R3.1 0.25,-259.75 1.62,-261.12 1.62,-264 0.88,-264.75 0.88,-265.88 PAD10.1 0.25,-266.88 -1.38,-266.88 IC2.28
  pour Top (isolate 0.5, no thermals): -1.25,-267.12 -1.25,-266.75 0.25,-265.25 1,-265.25 1,-267.5 -1,-267.5 -1.25,-267.25
SDA
  Top 0.5: 2.25,-259.69 R2.2 2.25,-260.25 2.5,-260.5 2.5,-264.38 2,-264.88 2,-268 1.12,-268.88 PAD9.1 -0.5,-268.75 -1.12,-268.12 -1.5,-268.12 IC2.27
  pour Top (isolate 0.5, no thermals): -1,-268.38 1.62,-268.38 2,-268 2,-269.38 1.12,-269.38 0.75,-269.75 -0.12,-269.75 -1,-268.88
SH  (via drill 0.8 pad 2.18)
  Top 0.5: -9.08,-274.58 IC2.13 -9.88,-275.37 -9.88,-275.38 -10.12,-275.62 -10.12,-277.5 -10.88,-278.25 -10.88,-280.75 -11.12,-281 v-11.12,-282.12
  Bottom 0.5: v-11.12,-282.12 -11.12,-278.88 -10.38,-278.12 -8.25,-278.12 -6.69,-276.57 R26.1
SL  (via drill 0.8 pad 2.18)
  Top 0.5: v-6.38,-264.88 -6.4,-265.25 IC2.1
  Bottom 0.406: -7.12,-267 -7.12,-270.75 | 0.5,-272.75 -2.25,-272.75 -2.5,-273
  Bottom 0.5: -7.12,-270.75 -7.12,-274.88 -6.62,-275.38 -4.38,-275.38 -3.62,-274.62 -3.62,-274.12 -2.5,-273 | v-6.38,-264.88 -7.12,-265.62 -7.12,-267 | R30.1 7.12,-270.62 | R32.2 7.12,-270.62 | 0.5,-272.75 3.75,-272.75 5.25,-274.25 6.62,-274.25 7.12,-273.75 7.12,-270.62
T  (via drill 0.8 pad 2.18)
  Top 0.5: Q4.4 12.88,-275.25 v10.25,-275.25 | v10.25,-275.25 10.45,-275.3 | R20.2 v10.25,-275.25
  Top 2.184: v10.25,-275.25 11.62,-275.25 15.38,-279
  Bottom 0.5: v10.25,-275.25 10.2,-275.3 Q5.3
  pour Top (isolate 0.5, no thermals): 12.62,-276.12 12.62,-284.88 28.5,-284.88 28.5,-276.12
  pour Bottom (no thermals): 9.5,-275 9.5,-276.88 10.88,-276.88 11.88,-275.88 11.88,-274.62 11.62,-274.38 9.88,-274.38 9.5,-274.75 9.5,-274.88
TL  (via drill 0.8 pad 2)
  Top 0.5: IC2.14 -9.38,-276 -9.38,-277.62 -6.62,-280.38 v-6.62,-281.88
  Bottom 0.5: -6.62,-281.12 v-6.62,-281.88 | R31.2 8,-282.25 7.12,-283.12 -5.38,-283.12 v-6.62,-281.88 | R29.1 -6.12,-281.38 v-6.62,-281.88
V5  (via drill 0.8 pad 2.18)  (1 unrouted)
  Top 0.305: -11.5,-271.25 -10.75,-271.25
  Top 0.406: -10.75,-271.25 -10.12,-271.25
  Top 0.5: IC2.4 -9.08,-267.92 -9.88,-267.12 -11.12,-267.12 | v-14.62,-270.75 -14.12,-271.25 -11.5,-271.25 | IC2.18 -5.5,-274.91 -5.5,-274.5 | -2.88,-260.62 -2.88,-260.88 -2.83,-260.92 R4.2 | R2.1 R3.2 -1.68,-257.18 -2.5,-258 -2.5,-260.25 -2.83,-260.58 R4.2 | -11.12,-267.12 -11.12,-266.38 -12.38,-265.12 -12.38,-262.75 -11.62,-262 -11,-262 -9.62,-260.62 -4.25,-260.62 -3.75,-261.12 -2.85,-261.12 R4.2 | -11.12,-267.12 -11.12,-268.16 IC2.6 -9.14,-270.14 -9.14,-270.23 | -13.79,-273.19 C4.1 | C1.1 -13.8,-274.71 C4.1 | C4.1 -13.75,-273.73 -13.75,-271.88 -14.62,-271 v-14.62,-270.75 | C8.2 -14.12,-268.25 -14.12,-269.25 -14.62,-269.75 v-14.62,-270.75
  Top 0.61: -5.5,-274.5 -9.14,-270.86 | -9.14,-270.86 -9.14,-270.23 | -9.14,-270.86 -9.62,-271.25 -10.12,-271.25
  Bottom 0.5: IC1.3 -10.62,-273.38 -11.62,-272.38 | -11.62,-272.38 -13.25,-270.75 v-14.62,-270.75 | PAD2.1 PAD8.1 | PAD8.1 -10.38,-269 | PAD8.1 -10.38,-272.12 -10.62,-272.38 -11.62,-272.38
  pour Bottom (isolate 0.5, no thermals): -14,-276.12 -8.12,-276.12 -8.12,-269 -8.75,-266.25 -17.75,-266.25 -17.75,-269 -14,-272.75
VCC
  Bottom 0.5: Q5.4 12.38,-284.75 2.88,-284.75 -13.12,-284.78 | -13.12,-284.78 -17.38,-284.75 -17.38,-271.38 -17.62,-271.12 -17.62,-270.38 -17.12,-269.88 -16.5,-269.88 -16,-269.38 -16,-267.62 -15.38,-267 -14,-267 -12.75,-265.75 | Q5.4 Q7.4 17.5,-262.94 | Q5.4 17.5,-280.12 | -13.12,-284.78 -13.15,-283.43 -13.15,-281.57 IC1.2 -13.27,-280.82 C7.2 | -9.75,-263.89 IC3.6 -9.79,-265.41 -10.12,-265.75 -12.75,-265.75 | R5.1 -13.5,-263.89 -13.5,-265.38 -13.12,-265.75 -12.75,-265.75
  Bottom 0.61: Q3.4 17.5,-262.94
  pour Bottom (isolate 0.4, no thermals): -17.75,-270.75 -17.38,-270.75 -15.12,-273 -15.12,-279.88 -11.62,-283.38 13.62,-283.38 14.88,-282.12 14.88,-256.62 28.38,-256.62 28.5,-284.88 -17.75,-284.88
VDD
  Bottom 0.5: D1.C -4.61,-268.8 C11.2 C5.2 | R8.2 -4.08,-262.12 -3.75,-262.12 -3.25,-261.62 -0.88,-261.62 0.32,-262.82 R16.2 0.5,-263.88 1.12,-264.5 | R35.1 -2,-269.85 C5.2 | T3.3 | T3.3 1.12,-264.5 | 1.12,-264.5 0.12,-265.5 R28.2 0.12,-267.12 -0.38,-267.62 -1.5,-267.62 -2,-268.12 C5.2
  pour Bottom (no thermals): -4.38,-269 -1.62,-269 -1.5,-269.25 -1.5,-269.62 -3.88,-269.62 -4.38,-269.12